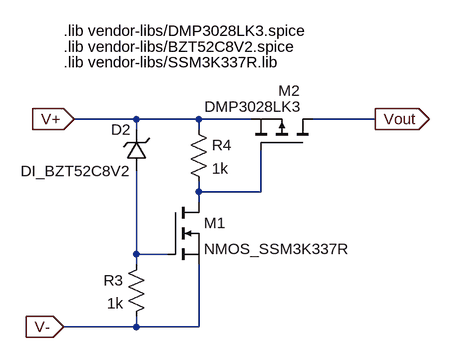
[diagram p0: schematic myuv.asc]
myuv.asc, the LTspice schematic file:
Version 4
SHEET 1 1640 680
WIRE 944 64 848 64
WIRE 1040 64 944 64
WIRE 1120 64 1040 64
WIRE 1312 64 1216 64
WIRE 944 80 944 64
WIRE 1040 80 1040 64
WIRE 1040 176 1040 160
WIRE 1136 176 1136 112
WIRE 1136 176 1040 176
WIRE 1040 192 1040 176
WIRE 944 272 944 144
WIRE 992 272 944 272
WIRE 944 288 944 272
WIRE 944 384 944 368
WIRE 944 384 832 384
WIRE 1040 384 1040 288
WIRE 1040 384 944 384
FLAG 1312 64 Vout
IOPIN 1312 64 Out
FLAG 848 64 V+
IOPIN 848 64 In
FLAG 832 384 V-
IOPIN 832 384 In
SYMBOL res 960 272 M0
SYMATTR InstName R3
SYMATTR Value 1k
SYMBOL res 1024 64 R0
SYMATTR InstName R4
SYMATTR Value 1k
SYMBOL zener 960 144 R180
WINDOW 0 24 64 Left 2
WINDOW 3 24 0 Left 2
SYMATTR InstName D2
SYMATTR Value DI_BZT52C8V2
SYMATTR Prefix X
SYMBOL nmos 992 192 R0
SYMATTR InstName M1
SYMATTR Value NMOS_SSM3K337R
SYMATTR Prefix X
SYMBOL pmos 1216 112 M270
WINDOW 0 92 20 VRight 2
WINDOW 3 67 17 VRight 2
SYMATTR InstName M2
SYMATTR Value DMP3028LK3
SYMATTR Prefix X
TEXT 832 -72 Left 2 !.lib vendor-libs/DMP3028LK3.spice
TEXT 832 -48 Left 2 !.lib vendor-libs/BZT52C8V2.spice
TEXT 832 -24 Left 2 !.lib vendor-libs/SSM3K337R.lib

The netlist it stands for:
* myuv.asc
R3 N002 V- 1k
R4 V+ N001 1k
XD2 N002 V+ DI_BZT52C8V2  ; pins + -
XM1 N001 N002 V- NMOS_SSM3K337R  ; pins D G S
XM2 Vout N001 V+ DMP3028LK3  ; pins D G S
.lib vendor-libs/DMP3028LK3.spice
.lib vendor-libs/BZT52C8V2.spice
.lib vendor-libs/SSM3K337R.lib
.backanno
.end